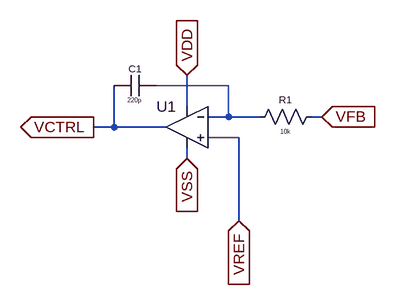
[diagram p0: schematic exp3-block.asc]
exp3-block.asc, the LTspice schematic file:
Version 4
SHEET 1 880 680
WIRE 432 272 320 272
WIRE 368 304 368 256
WIRE 432 320 432 272
WIRE 432 320 400 320
WIRE 480 320 432 320
WIRE 576 320 560 320
WIRE 256 336 256 272
WIRE 256 336 224 336
WIRE 336 336 256 336
WIRE 448 352 400 352
WIRE 368 384 368 368
WIRE 448 480 448 352
FLAG 368 256 VDD
IOPIN 368 256 In
FLAG 576 320 VFB
IOPIN 576 320 In
FLAG 448 480 VREF
IOPIN 448 480 In
FLAG 224 336 VCTRL
IOPIN 224 336 Out
FLAG 368 384 VSS
IOPIN 368 384 In
SYMBOL res 576 304 R90
WINDOW 0 0 56 VBottom 1
WINDOW 3 32 56 VTop 0
SYMATTR InstName R1
SYMATTR Value 10k
SYMBOL cap 320 256 R90
WINDOW 0 0 32 VBottom 1
WINDOW 3 32 32 VTop 0
SYMATTR InstName C1
SYMATTR Value 220p
SYMBOL Opamps/UniversalOpamp2 368 336 M0
SYMATTR InstName U1

The netlist it stands for:
* exp3-block.asc
R1 VFB N001 10k
C1 N001 VCTRL 220p
XU1 VREF N001 VDD VSS VCTRL level.2 Avol=1Meg GBW=10Meg Slew=10Meg ilimit=25m rail=0 Vos=0 phimargin=45 en=0 enk=0 in=0 ink=0 Rin=500Meg  ; pins IN+ IN- V+ V- OUT
.lib UniversalOpamps2.sub
.backanno
.end